# Altium project voltage sensor.PrjPcb
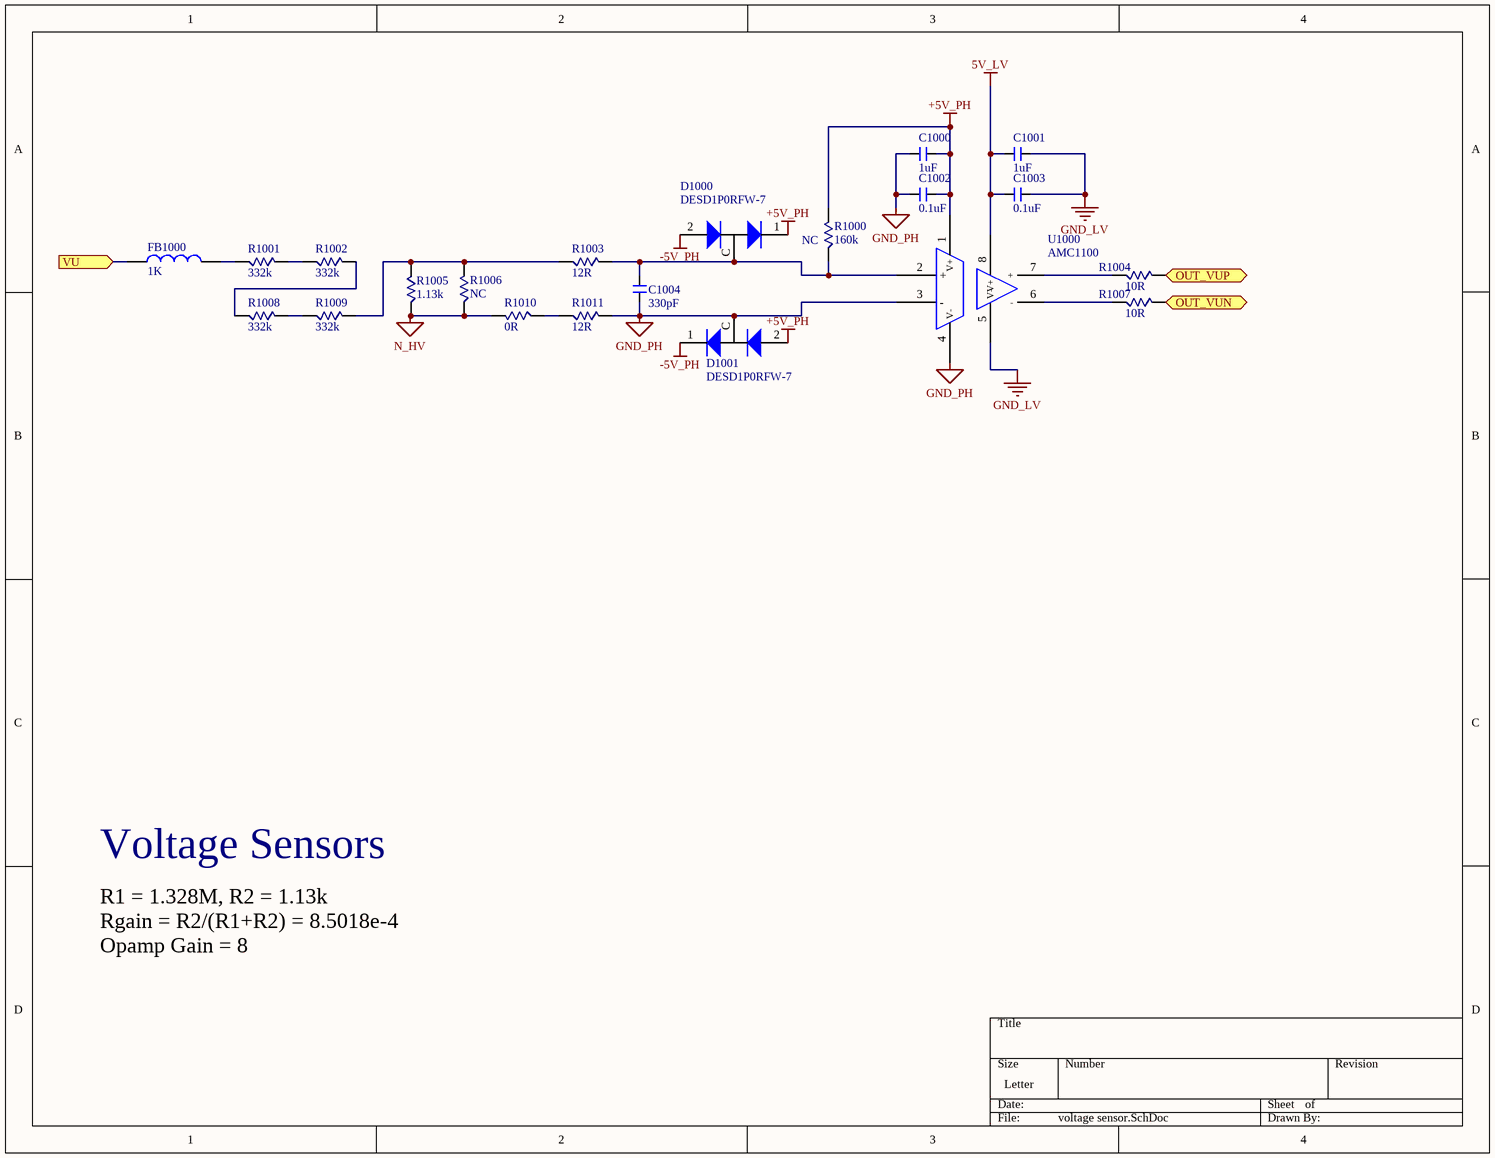
[diagram p0: voltage sensor.SchDoc]
1 sheet, 21 parts. Net scope: flat (ports and power ports of the same name join across sheets).
Board file: voltage sensor.PcbDoc

## Sheet voltage sensor.SchDoc
size Letter

### Parts
C1000  value 1uF  [0603 (1608 Metric)]  (hidden comment: Cap 0603_new)
C1001  value 1uF  [0603 (1608 Metric)]  (hidden comment: Cap 0603_new)
C1002  value 0.1uF  [0603 (1608 Metric)]  (hidden comment: Cap 0603_new)
C1003  value 0.1uF  [0603 (1608 Metric)]  (hidden comment: Cap 0603_new)
C1004  value 330pF  [0603 (1608 Metric)]  (hidden comment: Cap 0603_new)
D1000  Part: DESD1P0RFW-7  [SOT323_ESD]  (hidden comment: Diode_ESD)
D1001  Part: DESD1P0RFW-7  [SOT323_ESD]  (hidden comment: Diode_ESD)
FB1000  value 1K  [0603 (1608 Metric)]  (hidden comment: Ferrite bead)
R1000  NC  value 160k  [0603 (1608 Metric)]
R1001  value 332k  [1206]  (hidden comment: Resistor 1206)
R1002  value 332k  [1206]  (hidden comment: Resistor 1206)
R1003  value 12R  [1206]  (hidden comment: Resistor 1206)
R1004  value 10R  [0603 (1608 Metric)]  (hidden comment: Resistor 0603)
R1005  value 1.13k  [1206]  (hidden comment: Resistor 1206)
R1006  value NC  [1206]  (hidden comment: Resistor 1206)
R1007  value 10R  [0603 (1608 Metric)]  (hidden comment: Resistor 0603)
R1008  value 332k  [1206]  (hidden comment: Resistor 1206)
R1009  value 332k  [1206]  (hidden comment: Resistor 1206)
R1010  value 0R  [0603 (1608 Metric)]  (hidden comment: Resistor 0603)
R1011  value 12R  [1206]  (hidden comment: Resistor 1206)
U1000  AMC1100  [SOP8]

### Ports
OUT_VUN (out), OUT_VUP (out), VU (in)

### Nets
5V_LV: C1001.1(OUT) C1003.1(OUT) U1000.8(V+)
+5V_PH: C1000.2(OUT) C1002.2(OUT) D1000.1(Anode) D1001.2(Anode) R1000.2(A) U1000.1(V+)
-5V_PH: D1000.2(Anode) D1001.1(Anode)
GND_LV: C1001.2(OUT) C1003.2(OUT) U1000.5(V-)
GND_PH: C1000.1(OUT) C1002.1(OUT) C1004.2(OUT) D1001.C(Cathode) R1011.2(A) U1000.3(-) U1000.4(V-)
N_HV: R1005.1(A) R1006.1(A) R1010.2(A)
NetC1004_1: C1004.1(OUT) D1000.C(Cathode) R1000.1(A) R1003.2(A) U1000.2(+)
NetFB1000_1: FB1000.1(OUT) ; port VU
NetFB1000_2: FB1000.2(OUT) R1001.1(A)
NetR1001_2: R1001.2(A) R1002.1(A)
NetR1002_2: R1002.2(A) R1008.1(A)
NetR1003_1: R1003.1(A) R1005.2(A) R1006.2(A) R1009.2(A)
NetR1004_1: R1004.1(A) U1000.7(+)
NetR1004_2: R1004.2(A) ; port OUT_VUP
NetR1007_1: R1007.1(A) U1000.6(-)
NetR1007_2: R1007.2(A) ; port OUT_VUN
NetR1008_2: R1008.2(A) R1009.1(A)
NetR1010_1: R1010.1(A) R1011.1(A)

### Notes on the sheet
- Voltage Sensors
- R1 = 1.328M, R2 = 1.13k
  Rgain = R2/(R1+R2) = 8.5018e-4
  Opamp Gain = 8
  Vmax = 220.5415V

### Library data of the parts
C1000 C1001 = Cap 0603_new: CAP CER 1UF 50V X5R 0603; part: 1276-1860-1-ND
C1002 C1003 = Cap 0603_new: CAP CER 0.1UF 50V Y5V 0603; part: 311-1343-6-ND
C1004 = Cap 0603_new: CAP CER 330PF 50V C0G 0603; part: 445-7033-2-ND
D1000 D1001 = Diode_ESD: Value: ESD
FB1000 = Ferrite bead: FERRITE BEAD 1 KOHM 0603 1LN; Part: 445-8672-1-ND
R1000 = Resistor 0603
R1001 R1002 R1008 R1009 = Resistor 1206: RES SMD 332K OHM 0.1% 1/4W 1206; Part: RG32P332KBCT-ND
R1003 R1011 = Resistor 1206: 12 Ohm ±0.5% 0.25W, 1/4W Chip Resistor 1206; Part: 311-2961-1-ND
R1004 R1007 = Resistor 0603: RES SMD 10 OHM 0.05% 1/10W 0603; Part: RNCF0603AKT10R0CT-ND
R1005 = Resistor 1206: RES SMD 1.13K OHM 0.1% 1/4W 1206; Part: P1.13KBCCT-ND